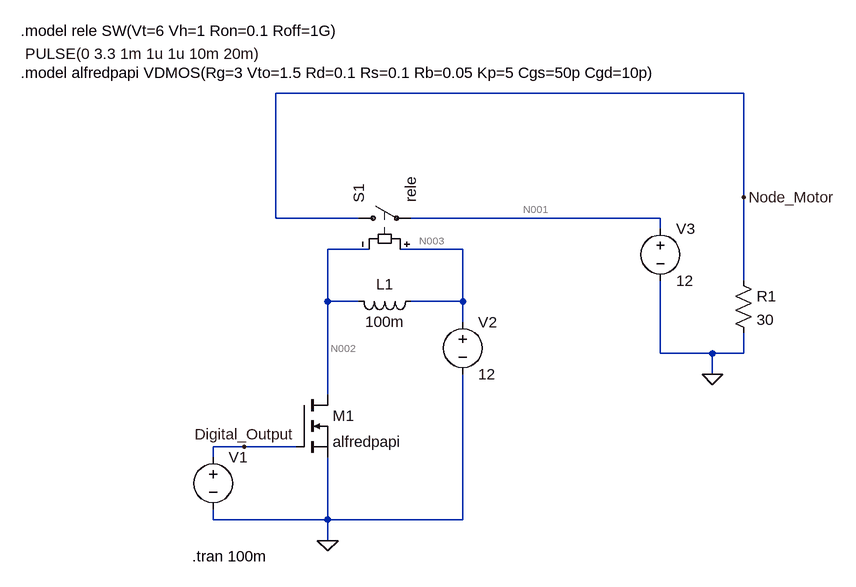
[diagram p0: schematic control_MOSFET&RELE.asc]
control_MOSFET&RELE.asc, the LTspice schematic file:
Version 4.1
SHEET 1 936 680
WIRE 832 -464 112 -464
WIRE 832 -304 832 -464
WIRE 112 -272 112 -464
WIRE 240 -272 112 -272
WIRE 704 -272 320 -272
WIRE 704 -256 704 -272
WIRE 256 -224 192 -224
WIRE 400 -224 304 -224
WIRE 832 -176 832 -304
WIRE 192 -144 192 -224
WIRE 240 -144 192 -144
WIRE 400 -144 400 -224
WIRE 400 -144 320 -144
WIRE 400 -112 400 -144
WIRE 704 -64 704 -176
WIRE 784 -64 704 -64
WIRE 832 -64 832 -96
WIRE 832 -64 784 -64
WIRE 784 -32 784 -64
WIRE 192 0 192 -144
WIRE 64 80 16 80
WIRE 144 80 64 80
WIRE 16 96 16 80
WIRE 16 192 16 176
WIRE 192 192 192 96
WIRE 192 192 16 192
WIRE 400 192 400 -32
WIRE 400 192 192 192
WIRE 192 224 192 192
FLAG 192 224 0
FLAG 784 -32 0
FLAG 64 80 Digital_Output
FLAG 832 -304 Node_Motor
SYMBOL nmos 144 0 R0
SYMATTR InstName M1
SYMATTR Value alfredpapi
SYMBOL voltage 16 80 R0
WINDOW 123 0 0 Left 0
WINDOW 39 0 0 Left 0
WINDOW 3 -289 -605 Left 2
SYMATTR Value PULSE(0 3.3 1m 1u 1u 10m 20m)
SYMATTR InstName V1
SYMBOL voltage 400 -128 R0
SYMATTR InstName V2
SYMATTR Value 12
SYMBOL sw 224 -272 R270
SYMATTR InstName S1
SYMATTR Value rele
SYMBOL ind 336 -160 R90
WINDOW 0 5 56 VBottom 2
WINDOW 3 32 56 VTop 2
SYMATTR InstName L1
SYMATTR Value 100m
SYMATTR SpiceLine Rser=400
SYMBOL voltage 704 -272 R0
WINDOW 123 0 0 Left 0
WINDOW 39 0 0 Left 0
SYMATTR InstName V3
SYMATTR Value 12
SYMBOL res 816 -192 R0
SYMATTR InstName R1
SYMATTR Value 30
TEXT -16 248 Left 2 !.tran 100m
TEXT -280 -496 Left 2 !.model alfredpapi VDMOS(Rg=3 Vto=1.5 Rd=0.1 Rs=0.1 Rb=0.05 Kp=5 Cgs=50p Cgd=10p)
TEXT -280 -560 Left 2 !.model rele SW(Vt=6 Vh=1 Ron=0.1 Roff=1G)

The netlist it stands for:
* control_MOSFET&RELE.asc
M1 N002 Digital_Output 0 0 alfredpapi
V1 Digital_Output 0 PULSE(0 3.3 1m 1u 1u 10m 20m)
V2 N003 0 12
S1 Node_Motor N001 N003 N002 rele
L1 N003 N002 100m Rser=400
V3 N001 0 12
R1 Node_Motor 0 30
.model NMOS NMOS
.model PMOS PMOS
.lib standard.mos
.tran 100m
.model alfredpapi VDMOS(Rg=3 Vto=1.5 Rd=0.1 Rs=0.1 Rb=0.05 Kp=5 Cgs=50p Cgd=10p)
.model rele SW(Vt=6 Vh=1 Ron=0.1 Roff=1G)
.backanno
.end

* Results of the author's LTspice run, read from the files saved beside the schematic
* Operating Point, zero values left out:
*   V(n001) = 12 V
*   V(n002) = 12 V
*   V(n003) = 12 V
*   V(node_motor) = 360.4 nV
*   I(L1) = 24.01 pA
*   I(R1) = 12.01 nA
*   I(S1) = 12.01 nA
*   I(V2) = -24.01 pA
*   I(V3) = -12.01 nA
*   Id(M1) = 12.01 pA
*   Is(M1) = -12.01 pA
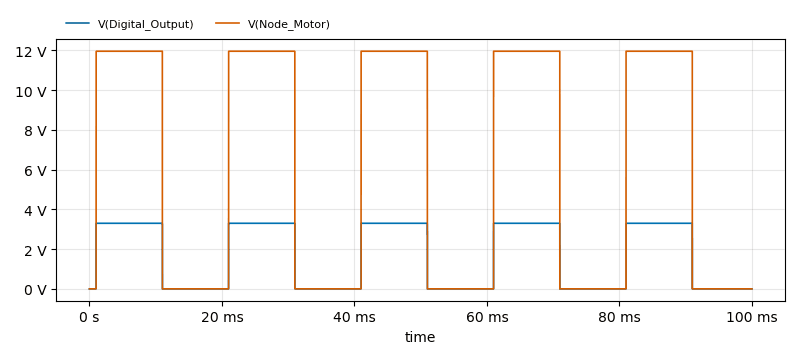
[diagram p1: Transient Analysis of control_MOSFET&RELE.asc, plotted from the saved traces]
* Transient Analysis, 1 run:
*   V(Digital_Output): min 0 V, max 3.3 V, average 1.65 V, rms 2.334 V, last 0 V
*   V(Node_Motor): min 0 V, max 11.96 V, average 5.981 V, rms 8.458 V, last 0 V